# Altium schematic sheet half-bridge.SchDoc
size 431 x 279 mm; SheetNumber: 4; SheetTotal: 5
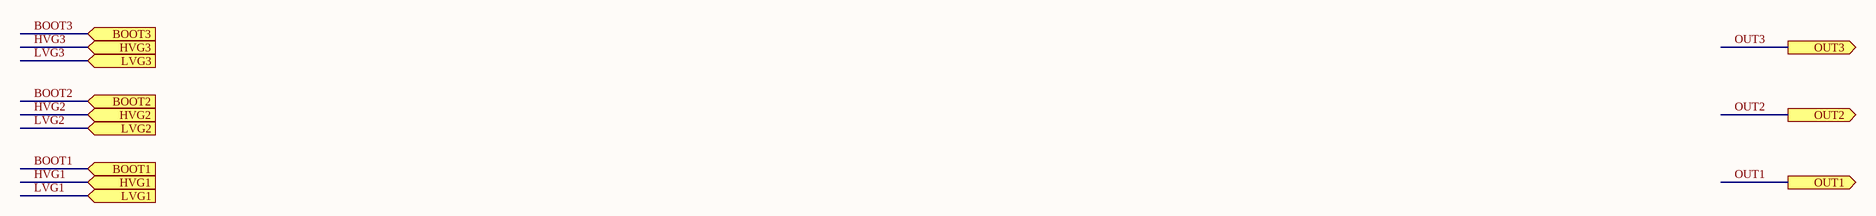
[diagram p0: half-bridge.SchDoc]

## Ports
BOOT1 (in), BOOT2 (in), BOOT3 (in), HVG1 (in), HVG2 (in), HVG3 (in), LVG1 (in), LVG2 (in), LVG3 (in), OUT1 (out), OUT2 (out), OUT3 (out)

## Nets
BOOT1: port BOOT1
BOOT2: port BOOT2
BOOT3: port BOOT3
HVG1: port HVG1
HVG2: port HVG2
HVG3: port HVG3
LVG1: port LVG1
LVG2: port LVG2
LVG3: port LVG3
OUT1: port OUT1
OUT2: port OUT2
OUT3: port OUT3

## Notes on the sheet
- DWG. NO.
- REV.
- SHT.
- THIS DOCUMENT AND THE DATA DISCLOSED HEREIN OR HEREWITH IS THE PROPERTY OF ALTIUM LIMITED AND MAY BE FREELY DISTRIBUTED IN WHOLE. NO RIGHTS ARE RESERVED OR EXPRESS OR IMPLIED WARANTEE GIVEN.
- REVISION
- DESCRIPTION
- DATE
- APPROVED
- ENG:
- APPROVALS
- PROJECT
- DSN:
- CHK:
- REFERENCE DOCUMENTS
- PROJECT REVISION:
- TITLE
- DOCUMENT REVISION:
- DESIGN ITEM:
- BOM:
- FAB DWG:
- PCB DWG:
- ASSY DWG:
- SCALE:
- SIZE
- B
- CAGE CODE
- FILE NAME
- DWG NO.
- SHEET
- OF
- REV